# Altium project STM32F407_PLC_20260104.PrjPcb (part 2 of 2)
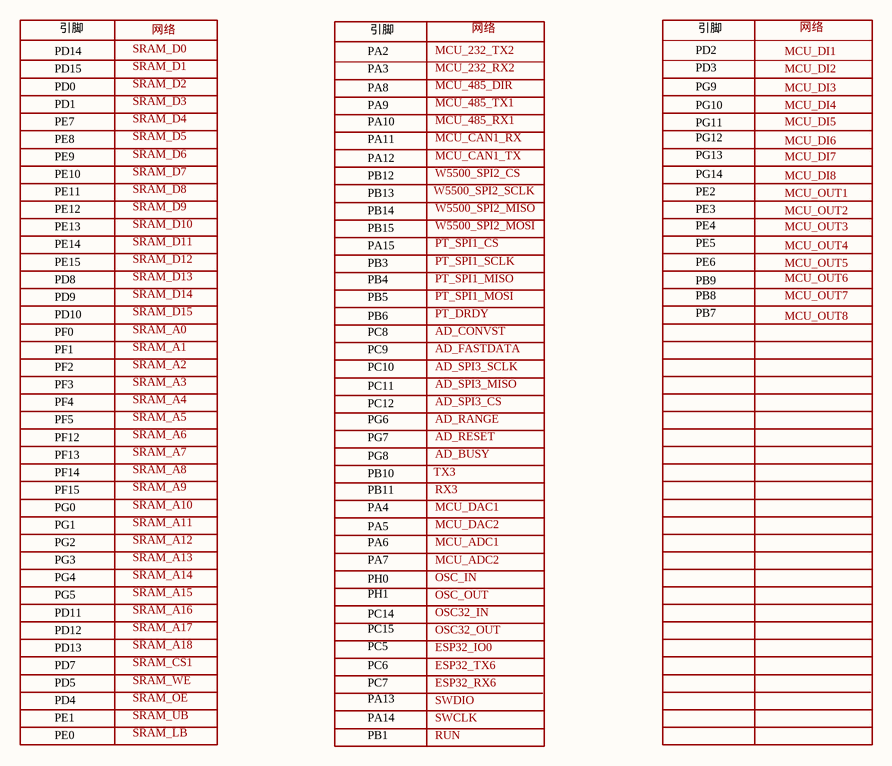
[diagram p8: 网表.SchDoc]

## Nets that join several sheets
3.3V: 单片机 (38 pins), 电源 (10 pins), 光耦开关量输入输出 (8 pins), 串口通信电路 (C60.2 U14.6), 模拟量采集电路 (9 pins), 网络通信电路 (15 pins)
5V: 电源 (13 pins), 串口通信电路 (12 pins), 模拟量输入输出电路 (Q1.3 U20.8 U21.8 U22.8), 模拟量采集电路 (R66.1)
24V: 电源 (8 pins), 光耦开关量输入输出 (28 pins), 模拟量输入输出电路 (U23.8)
GND: 单片机 (38 pins), 电源 (25 pins), 光耦开关量输入输出 (11 pins), 串口通信电路 (22 pins), 模拟量输入输出电路 (20 pins), 模拟量采集电路 (8 pins), 网络通信电路 (37 pins)
PGND: 单片机 (SCREW1.1 SCREW2.1 SCREW3.1 SCREW4.1), 串口通信电路 (9 pins)
AD_BUSY: 单片机 (U1.93), 模拟量采集电路 (U16.14)
AD_CONVST: 单片机 (U1.98), 模拟量采集电路 (U16.9 U16.10)
AD_FASTDATA: 单片机 (U1.99), 模拟量采集电路 (U16.15)
AD_RANGE: 单片机 (U1.91), 模拟量采集电路 (R54.2)
AD_RESET: 单片机 (U1.92), 模拟量采集电路 (U16.11)
AD_SPI3_CS: 单片机 (U1.113), 模拟量采集电路 (U16.13)
AD_SPI3_MISO: 单片机 (U1.112), 模拟量采集电路 (U16.24)
AD_SPI3_SCLK: 单片机 (U1.111), 模拟量采集电路 (U16.12)
ESP32_IO0: 单片机 (U1.45), 网络通信电路 (U19.27)
ESP32_RX6: 单片机 (U1.97), 网络通信电路 (U19.37)
ESP32_TX6: 单片机 (U1.96), 网络通信电路 (U19.36)
MCU_232_RX2: 单片机 (U1.37), 串口通信电路 (R41.2 R43.2)
MCU_232_TX2: 单片机 (U1.36), 串口通信电路 (U12.9)
MCU_485_DIR: 单片机 (U1.100), 串口通信电路 (U10.4 U10.5)
MCU_485_RX1: 单片机 (U1.102), 串口通信电路 (R35.1 R36.2)
MCU_485_TX1: 单片机 (U1.101), 串口通信电路 (U10.6)
MCU_ADC1: 单片机 (U1.42), 模拟量输入输出电路 (C101.2 R92.1)
MCU_ADC2: 单片机 (U1.43), 模拟量输入输出电路 (C102.2 R93.1)
MCU_CAN1_RX: 单片机 (U1.103), 串口通信电路 (U14.4)
MCU_CAN1_TX: 单片机 (U1.104), 串口通信电路 (U14.5)
MCU_DAC1: 单片机 (U1.40), 模拟量输入输出电路 (R103.2)
MCU_DAC2: 单片机 (U1.41), 模拟量输入输出电路 (R106.2)
MCU_DI1: 单片机 (U1.116), 光耦开关量输入输出 (R9.2 U7.16)
MCU_DI2: 单片机 (U1.117), 光耦开关量输入输出 (R13.2 U7.14)
MCU_DI3: 单片机 (U1.124), 光耦开关量输入输出 (R17.2 U7.12)
MCU_DI4: 单片机 (U1.125), 光耦开关量输入输出 (R21.2 U7.10)
MCU_DI5: 单片机 (U1.126), 光耦开关量输入输出 (R11.2 U8.16)
MCU_DI6: 单片机 (U1.127), 光耦开关量输入输出 (R15.2 U8.14)
MCU_DI7: 单片机 (U1.128), 光耦开关量输入输出 (R19.2 U8.12)
MCU_DI8: 单片机 (U1.129), 光耦开关量输入输出 (R23.2 U8.10)
MCU_OUT1: 单片机 (U1.1), 光耦开关量输入输出 (U9.1)
MCU_OUT2: 单片机 (U1.2), 光耦开关量输入输出 (U9.2)
MCU_OUT3: 单片机 (U1.3), 光耦开关量输入输出 (U9.3)
MCU_OUT4: 单片机 (U1.4), 光耦开关量输入输出 (U9.4)
MCU_OUT5: 单片机 (U1.5), 光耦开关量输入输出 (U9.5)
MCU_OUT6: 单片机 (U1.140), 光耦开关量输入输出 (U9.6)
MCU_OUT7: 单片机 (U1.139), 光耦开关量输入输出 (U9.7)
MCU_OUT8: 单片机 (U1.137), 光耦开关量输入输出 (U9.8)
PT_DRDY: 单片机 (U1.136), 模拟量采集电路 (U17.18)
PT_SPI1_CS: 单片机 (U1.110), 模拟量采集电路 (U17.13)
PT_SPI1_MISO: 单片机 (U1.134), 模拟量采集电路 (U17.14)
PT_SPI1_MOSI: 单片机 (U1.135), 模拟量采集电路 (U17.11)
PT_SPI1_SCLK: 单片机 (U1.133), 模拟量采集电路 (U17.12)
W5500_SPI2_CS: 单片机 (U1.73), 网络通信电路 (R82.1 U18.32)
W5500_SPI2_MISO: 单片机 (U1.75), 网络通信电路 (U18.34)
W5500_SPI2_MOSI: 单片机 (U1.76), 网络通信电路 (U18.35)
W5500_SPI2_SCLK: 单片机 (U1.74), 网络通信电路 (U18.33)